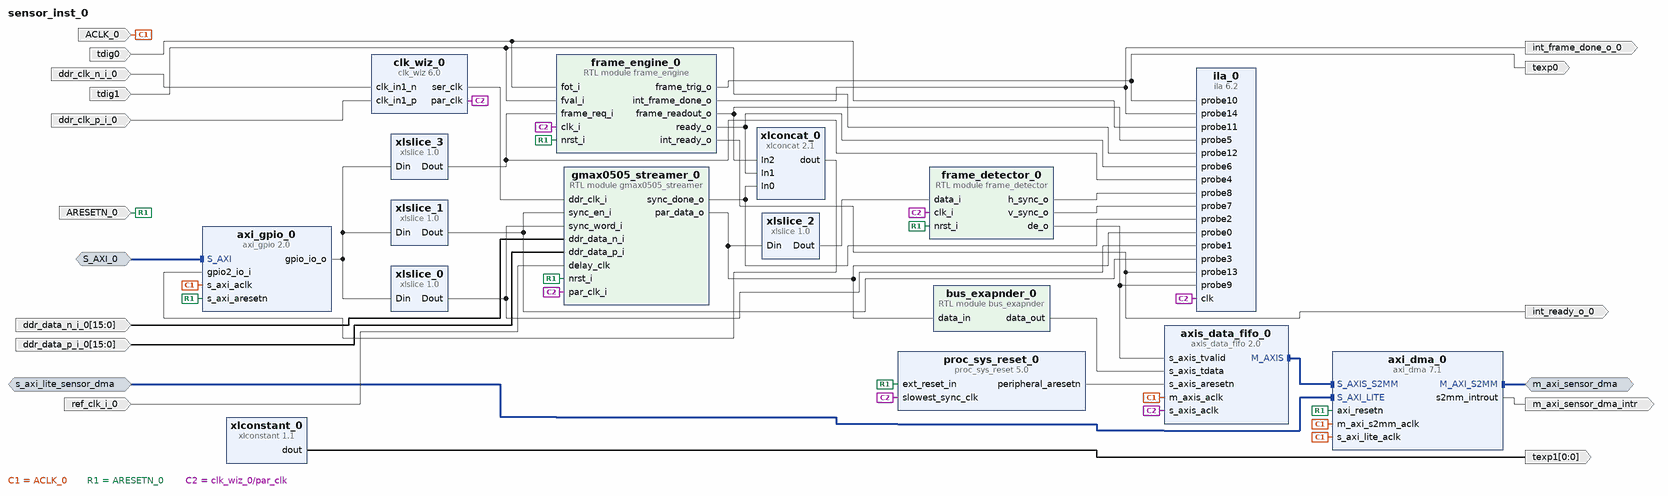
[diagram p0: block diagram of the top level]
# Vivado block design sensor_inst_0, xc7z020clg484-2, Vivado 2024.1
create_bd_design sensor_inst_0

create_bd_intf_port -mode Slave -vlnv xilinx.com:interface:aximm_rtl:1.0 S_AXI_0
create_bd_intf_port -mode Slave -vlnv xilinx.com:interface:aximm_rtl:1.0 s_axi_lite_sensor_dma
create_bd_intf_port -mode Master -vlnv xilinx.com:interface:aximm_rtl:1.0 m_axi_sensor_dma
create_bd_port -dir I -type clk ACLK_0
create_bd_port -dir I -type rst ARESETN_0
create_bd_port -dir I ref_clk_i_0
create_bd_port -dir I ddr_clk_p_i_0
create_bd_port -dir I ddr_clk_n_i_0
create_bd_port -dir I -from 15 -to 0 ddr_data_p_i_0
create_bd_port -dir I -from 15 -to 0 ddr_data_n_i_0
create_bd_port -dir I tdig0
create_bd_port -dir I tdig1
create_bd_port -dir O int_ready_o_0
create_bd_port -dir O int_frame_done_o_0
create_bd_port -dir O texp0
create_bd_port -dir O -from 0 -to 0 texp1
create_bd_port -dir O -type intr m_axi_sensor_dma_intr

create_bd_cell -type ip -vlnv xilinx.com:ip:axi_gpio:2.0 axi_gpio_0
set_property -dict [list \
  CONFIG.C_ALL_INPUTS 0 \
  CONFIG.C_ALL_INPUTS_2 1 \
  CONFIG.C_ALL_OUTPUTS 1 \
  CONFIG.C_GPIO2_WIDTH 3 \
  CONFIG.C_GPIO_WIDTH 14 \
  CONFIG.C_IS_DUAL 1 \
] [get_bd_cells axi_gpio_0]
create_bd_cell -type ip -vlnv xilinx.com:ip:xlslice:1.0 xlslice_0
set_property -dict {CONFIG.DIN_FROM 11 CONFIG.DIN_WIDTH 14 CONFIG.DOUT_WIDTH 12} [get_bd_cells xlslice_0]
create_bd_cell -type ip -vlnv xilinx.com:ip:xlslice:1.0 xlslice_1
set_property -dict {CONFIG.DIN_FROM 12 CONFIG.DIN_TO 12 CONFIG.DIN_WIDTH 14} [get_bd_cells xlslice_1]
create_bd_cell -type module -reference gmax0505_streamer gmax0505_streamer_0
create_bd_cell -type module -reference frame_detector frame_detector_0
create_bd_cell -type ip -vlnv xilinx.com:ip:xlslice:1.0 xlslice_2
set_property -dict {CONFIG.DIN_FROM 11 CONFIG.DIN_WIDTH 192 CONFIG.DOUT_WIDTH 12} [get_bd_cells xlslice_2]
create_bd_cell -type module -reference frame_engine frame_engine_0
create_bd_cell -type ip -vlnv xilinx.com:ip:xlslice:1.0 xlslice_3
set_property -dict {CONFIG.DIN_FROM 13 CONFIG.DIN_TO 13 CONFIG.DIN_WIDTH 14} [get_bd_cells xlslice_3]
create_bd_cell -type ip -vlnv xilinx.com:ip:xlconcat:2.1 xlconcat_0
set_property -dict {CONFIG.NUM_PORTS 3 CONFIG.dout_width 3} [get_bd_cells xlconcat_0]
create_bd_cell -type ip -vlnv xilinx.com:ip:xlconstant:1.1 xlconstant_0
set_property -dict {CONFIG.CONST_VAL 0} [get_bd_cells xlconstant_0]
create_bd_cell -type ip -vlnv xilinx.com:ip:clk_wiz:6.0 clk_wiz_0
set_property -dict [list \
  CONFIG.CLKIN1_JITTER_PS 50.0 \
  CONFIG.CLKOUT1_DRIVES BUFG \
  CONFIG.CLKOUT1_JITTER 140.399 \
  CONFIG.CLKOUT1_PHASE_ERROR 89.971 \
  CONFIG.CLKOUT1_REQUESTED_OUT_FREQ 33.33333 \
  CONFIG.CLKOUT2_DRIVES BUFG \
  CONFIG.CLKOUT2_JITTER 98.146 \
  CONFIG.CLKOUT2_PHASE_ERROR 89.971 \
  CONFIG.CLKOUT2_REQUESTED_OUT_FREQ 200 \
  CONFIG.CLKOUT2_USED true \
  CONFIG.CLKOUT3_DRIVES BUFG \
  CONFIG.CLKOUT4_DRIVES BUFG \
  CONFIG.CLKOUT5_DRIVES BUFG \
  CONFIG.CLKOUT6_DRIVES BUFG \
  CONFIG.CLKOUT7_DRIVES BUFG \
  CONFIG.CLK_OUT1_PORT par_clk \
  CONFIG.CLK_OUT2_PORT ser_clk \
  CONFIG.FEEDBACK_SOURCE FDBK_AUTO \
  CONFIG.MMCM_BANDWIDTH OPTIMIZED \
  CONFIG.MMCM_CLKFBOUT_MULT_F 5.000 \
  CONFIG.MMCM_CLKIN1_PERIOD 5.000 \
  CONFIG.MMCM_CLKIN2_PERIOD 10.0 \
  CONFIG.MMCM_CLKOUT0_DIVIDE_F 30.000 \
  CONFIG.MMCM_CLKOUT1_DIVIDE 5 \
  CONFIG.MMCM_COMPENSATION ZHOLD \
  CONFIG.MMCM_DIVCLK_DIVIDE 1 \
  CONFIG.NUM_OUT_CLKS 2 \
  CONFIG.PRIMITIVE MMCM \
  CONFIG.PRIM_IN_FREQ 200 \
  CONFIG.PRIM_SOURCE Differential_clock_capable_pin \
  CONFIG.USE_RESET false \
] [get_bd_cells clk_wiz_0]
create_bd_cell -type ip -vlnv xilinx.com:ip:ila:6.2 ila_0
set_property -dict [list \
  CONFIG.C_ADV_TRIGGER true \
  CONFIG.C_DATA_DEPTH 4096 \
  CONFIG.C_EN_STRG_QUAL 1 \
  CONFIG.C_MONITOR_TYPE Native \
  CONFIG.C_NUM_OF_PROBES 15 \
  CONFIG.C_PROBE0_WIDTH 192 \
  CONFIG.C_PROBE15_WIDTH 1 \
  CONFIG.C_PROBE16_WIDTH 1 \
  CONFIG.C_PROBE1_WIDTH 12 \
  CONFIG.C_TRIGIN_EN false \
] [get_bd_cells ila_0]
create_bd_cell -type ip -vlnv xilinx.com:ip:axi_dma:7.1 axi_dma_0
set_property -dict [list \
  CONFIG.c_include_mm2s 0 \
  CONFIG.c_include_s2mm_dre 1 \
  CONFIG.c_include_sg 0 \
  CONFIG.c_sg_length_width 26 \
] [get_bd_cells axi_dma_0]
create_bd_cell -type ip -vlnv xilinx.com:ip:axis_data_fifo:2.0 axis_data_fifo_0
set_property -dict [list \
  CONFIG.FIFO_DEPTH 4096 \
  CONFIG.HAS_TKEEP 0 \
  CONFIG.HAS_TLAST 0 \
  CONFIG.HAS_TSTRB 0 \
  CONFIG.IS_ACLK_ASYNC 1 \
  CONFIG.TDATA_NUM_BYTES 32 \
  CONFIG.TDEST_WIDTH 0 \
  CONFIG.TID_WIDTH 0 \
  CONFIG.TUSER_WIDTH 0 \
] [get_bd_cells axis_data_fifo_0]
create_bd_cell -type module -reference bus_exapnder bus_exapnder_0
create_bd_cell -type ip -vlnv xilinx.com:ip:proc_sys_reset:5.0 proc_sys_reset_0

# ---- connections ----

connect_bd_intf_net -intf_net S_AXI_0_1 [get_bd_intf_ports S_AXI_0] [get_bd_intf_pins axi_gpio_0/S_AXI]
connect_bd_intf_net -intf_net S_AXI_LITE_0_1 [get_bd_intf_ports s_axi_lite_sensor_dma] [get_bd_intf_pins axi_dma_0/S_AXI_LITE]
connect_bd_intf_net [get_bd_intf_ports m_axi_sensor_dma] [get_bd_intf_pins axi_dma_0/M_AXI_S2MM]
connect_bd_intf_net [get_bd_intf_pins axis_data_fifo_0/M_AXIS] [get_bd_intf_pins axi_dma_0/S_AXIS_S2MM]
connect_bd_net -net ACLK_0_1 [get_bd_ports ACLK_0] \
  [get_bd_pins axi_gpio_0/s_axi_aclk] [get_bd_pins axis_data_fifo_0/m_axis_aclk] [get_bd_pins axi_dma_0/s_axi_lite_aclk] \
  [get_bd_pins axi_dma_0/m_axi_s2mm_aclk]
connect_bd_net -net ARESETN_0_1 [get_bd_ports ARESETN_0] \
  [get_bd_pins axi_gpio_0/s_axi_aresetn] [get_bd_pins gmax0505_streamer_0/nrst_i] [get_bd_pins frame_engine_0/nrst_i] \
  [get_bd_pins frame_detector_0/nrst_i] [get_bd_pins axi_dma_0/axi_resetn] [get_bd_pins proc_sys_reset_0/ext_reset_in]
connect_bd_net [get_bd_pins axi_dma_0/s2mm_introut] [get_bd_ports m_axi_sensor_dma_intr]
connect_bd_net [get_bd_pins axi_gpio_0/gpio_io_o] [get_bd_pins xlslice_0/Din] [get_bd_pins xlslice_1/Din] [get_bd_pins xlslice_3/Din]
connect_bd_net [get_bd_pins bus_exapnder_0/data_out] [get_bd_pins axis_data_fifo_0/s_axis_tdata]
connect_bd_net [get_bd_pins clk_wiz_0/ser_clk] [get_bd_pins gmax0505_streamer_0/ddr_clk_i]
connect_bd_net -net ddr_clk_n_i_0_1 [get_bd_ports ddr_clk_n_i_0] [get_bd_pins clk_wiz_0/clk_in1_n]
connect_bd_net -net ddr_clk_p_i_0_1 [get_bd_ports ddr_clk_p_i_0] [get_bd_pins clk_wiz_0/clk_in1_p]
connect_bd_net -net ddr_data_n_i_0_1 [get_bd_ports ddr_data_n_i_0] [get_bd_pins gmax0505_streamer_0/ddr_data_n_i]
connect_bd_net -net ddr_data_p_i_0_1 [get_bd_ports ddr_data_p_i_0] [get_bd_pins gmax0505_streamer_0/ddr_data_p_i]
connect_bd_net -net fot_i_0_1 [get_bd_ports tdig0] [get_bd_pins ila_0/probe11] [get_bd_pins frame_engine_0/fot_i]
connect_bd_net [get_bd_pins frame_detector_0/de_o] [get_bd_pins ila_0/probe9] [get_bd_pins axis_data_fifo_0/s_axis_tvalid]
connect_bd_net [get_bd_pins frame_detector_0/h_sync_o] [get_bd_pins ila_0/probe8]
connect_bd_net [get_bd_pins frame_detector_0/v_sync_o] [get_bd_pins ila_0/probe7]
connect_bd_net [get_bd_pins frame_engine_0/frame_readout_o] [get_bd_pins xlconcat_0/In2] [get_bd_pins ila_0/probe5]
connect_bd_net [get_bd_pins frame_engine_0/frame_trig_o] [get_bd_ports texp0] [get_bd_pins ila_0/probe10]
connect_bd_net [get_bd_pins frame_engine_0/int_frame_done_o] [get_bd_ports int_frame_done_o_0] [get_bd_pins ila_0/probe14]
connect_bd_net [get_bd_pins frame_engine_0/int_ready_o] [get_bd_ports int_ready_o_0] [get_bd_pins ila_0/probe13]
connect_bd_net [get_bd_pins frame_engine_0/ready_o] [get_bd_pins xlconcat_0/In1] [get_bd_pins ila_0/probe6]
connect_bd_net -net fval_i_0_1 [get_bd_ports tdig1] [get_bd_pins ila_0/probe12] [get_bd_pins frame_engine_0/fval_i]
connect_bd_net -net gmax0505_streamer_0_par_clk_o [get_bd_pins clk_wiz_0/par_clk] \
  [get_bd_pins gmax0505_streamer_0/par_clk_i] [get_bd_pins ila_0/clk] [get_bd_pins frame_engine_0/clk_i] \
  [get_bd_pins frame_detector_0/clk_i] [get_bd_pins axis_data_fifo_0/s_axis_aclk] \
  [get_bd_pins proc_sys_reset_0/slowest_sync_clk]
connect_bd_net [get_bd_pins gmax0505_streamer_0/par_data_o] \
  [get_bd_pins xlslice_2/Din] [get_bd_pins ila_0/probe0] [get_bd_pins bus_exapnder_0/data_in]
connect_bd_net [get_bd_pins proc_sys_reset_0/peripheral_aresetn] [get_bd_pins axis_data_fifo_0/s_axis_aresetn]
connect_bd_net -net ref_clk_i_0_1 [get_bd_ports ref_clk_i_0] [get_bd_pins gmax0505_streamer_0/delay_clk]
connect_bd_net -net word_detector_0_detected_o1 [get_bd_pins gmax0505_streamer_0/sync_done_o] [get_bd_pins xlconcat_0/In0] [get_bd_pins ila_0/probe2]
connect_bd_net [get_bd_pins xlconcat_0/dout] [get_bd_pins axi_gpio_0/gpio2_io_i]
connect_bd_net [get_bd_pins xlconstant_0/dout] [get_bd_ports texp1]
connect_bd_net [get_bd_pins xlslice_0/Dout] [get_bd_pins gmax0505_streamer_0/sync_word_i] [get_bd_pins ila_0/probe1]
connect_bd_net [get_bd_pins xlslice_1/Dout] [get_bd_pins gmax0505_streamer_0/sync_en_i] [get_bd_pins ila_0/probe3]
connect_bd_net [get_bd_pins xlslice_2/Dout] [get_bd_pins frame_detector_0/data_i]
connect_bd_net [get_bd_pins xlslice_3/Dout] [get_bd_pins ila_0/probe4] [get_bd_pins frame_engine_0/frame_req_i]

# ---- address map ----
assign_bd_address -offset 0x00000000 -range 256M -target_address_space [get_bd_addr_spaces axi_dma_0/Data_S2MM] [get_bd_addr_segs m_axi_sensor_dma/:processing_system7_0:S_AXI_HP1:HP1_DDR_LOWOCM]
assign_bd_address -offset 0x0000 -range 64K -target_address_space [get_bd_addr_spaces S_AXI_0] [get_bd_addr_segs axi_gpio_0/S_AXI/Reg]
assign_bd_address -offset 0x0000 -range 64K -target_address_space [get_bd_addr_spaces s_axi_lite_sensor_dma] [get_bd_addr_segs axi_dma_0/S_AXI_LITE/Reg]

validate_bd_design
save_bd_design
